# Altium schematic sheet CD74HC4067_MUX.SchDoc
size A
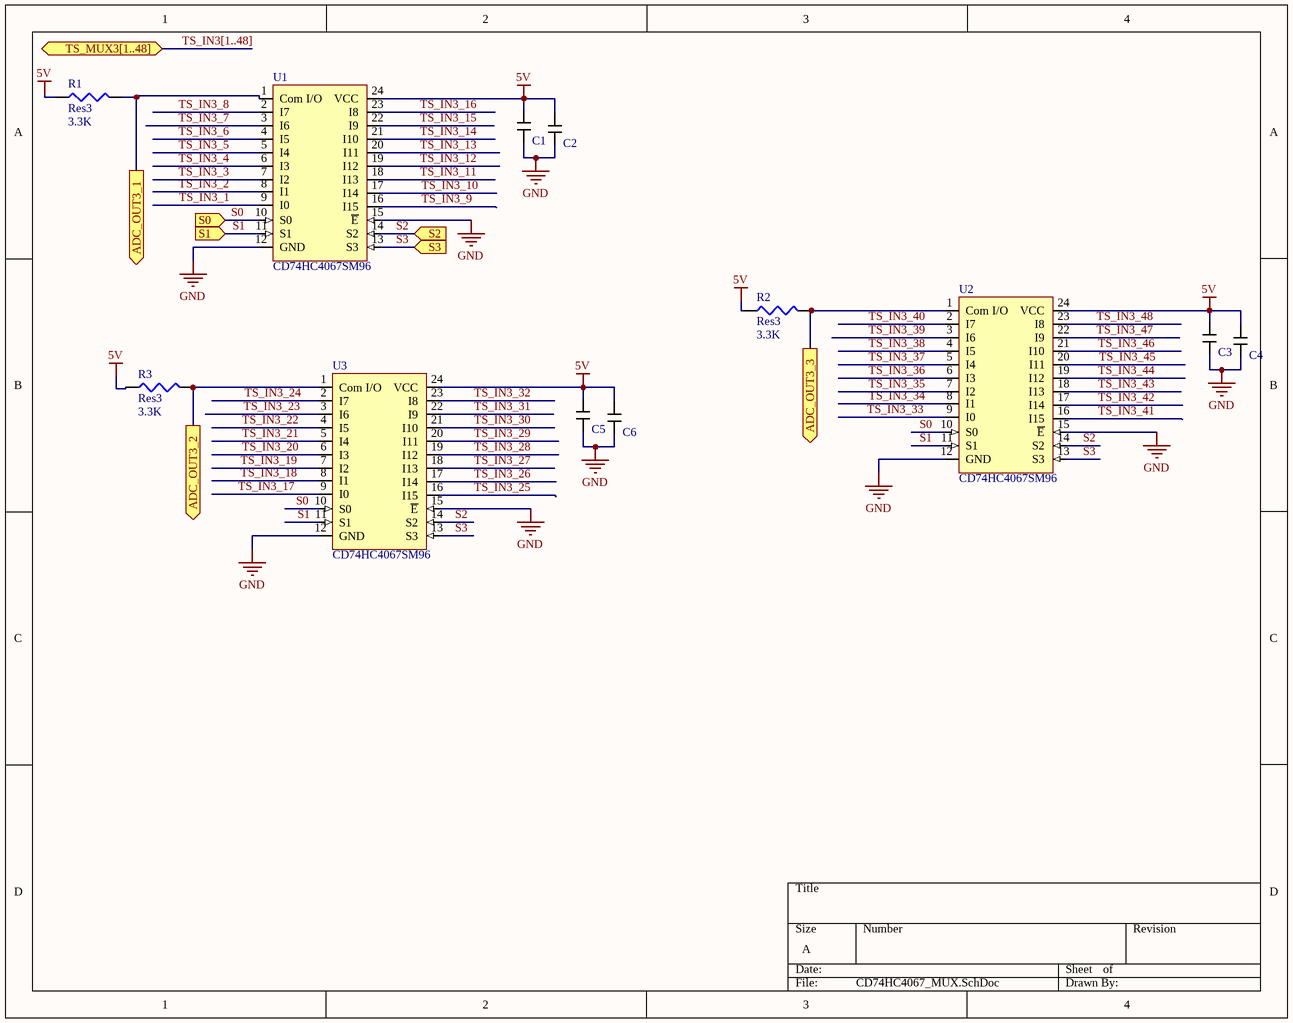
[diagram p0: CD74HC4067_MUX.SchDoc]

## Parts
C1  0.1uF Cap  [CAPC1608X09M]  (value not drawn)
C2  1uF Samsung Cap  [CAPC1608X09M]  (value not drawn)
C3  0.1uF Cap  [CAPC1608X09M]  (value not drawn)
C4  1uF Samsung Cap  [CAPC1608X09M]  (value not drawn)
C5  0.1uF Cap  [CAPC1608X09M]  (value not drawn)
C6  1uF Samsung Cap  [CAPC1608X09M]  (value not drawn)
R1  Res3  value 3.3K  [J1-0603]
R2  Res3  value 3.3K  [J1-0603]
R3  Res3  value 3.3K  [J1-0603]
U1  CD74HC4067SM96  [SOIC-24_MUX]
U2  CD74HC4067SM96  [SOIC-24_MUX]
U3  CD74HC4067SM96  [SOIC-24_MUX]

## Ports
ADC_OUT3_1 (out), ADC_OUT3_2 (out), ADC_OUT3_3 (out), S0 (in), S1 (in), S2 (in), S3 (in), TS_MUX3[1..48] (bidir)

## Nets
5V: C1.2 C2.2 C3.2 C4.2 C5.2 C6.2 R1.1 R2.1 R3.1 U1.24(VCC) U2.24(VCC) U3.24(VCC)
GND: C1.1 C2.1 C3.1 C4.1 C5.1 C6.1 U1.12(GND) U1.15(~{E}) U2.12(GND) U2.15(~{E}) U3.12(GND) U3.15(~{E})
ADC_OUT3_1: R1.2 U1.1(Com_I/O) ; port ADC_OUT3_1
ADC_OUT3_2: R3.2 U3.1(Com_I/O) ; port ADC_OUT3_2
ADC_OUT3_3: R2.2 U2.1(Com_I/O) ; port ADC_OUT3_3
S0: U1.10(S0) U2.10(S0) U3.10(S0) ; port S0
S1: U1.11(S1) U2.11(S1) U3.11(S1) ; port S1
S2: U1.14(S2) U2.14(S2) U3.14(S2) ; port S2
S3: U1.13(S3) U2.13(S3) U3.13(S3) ; port S3
TS_IN3_1: U1.9(I0)
TS_IN3_2: U1.8(I1)
TS_IN3_3: U1.7(I2)
TS_IN3_4: U1.6(I3)
TS_IN3_5: U1.5(I4)
TS_IN3_6: U1.4(I5)
TS_IN3_7: U1.3(I6)
TS_IN3_8: U1.2(I7)
TS_IN3_9: U1.16(I15)
TS_IN3_10: U1.17(I14)
TS_IN3_11: U1.18(I13)
TS_IN3_12: U1.19(I12)
TS_IN3_13: U1.20(I11)
TS_IN3_14: U1.21(I10)
TS_IN3_15: U1.22(I9)
TS_IN3_16: U1.23(I8)
TS_IN3_17: U3.9(I0)
TS_IN3_18: U3.8(I1)
TS_IN3_19: U3.7(I2)
TS_IN3_20: U3.6(I3)
TS_IN3_21: U3.5(I4)
TS_IN3_22: U3.4(I5)
TS_IN3_23: U3.3(I6)
TS_IN3_24: U3.2(I7)
TS_IN3_25: U3.16(I15)
TS_IN3_26: U3.17(I14)
TS_IN3_27: U3.18(I13)
TS_IN3_28: U3.19(I12)
TS_IN3_29: U3.20(I11)
TS_IN3_30: U3.21(I10)
TS_IN3_31: U3.22(I9)
TS_IN3_32: U3.23(I8)
TS_IN3_33: U2.9(I0)
TS_IN3_34: U2.8(I1)
TS_IN3_35: U2.7(I2)
TS_IN3_36: U2.6(I3)
TS_IN3_37: U2.5(I4)
TS_IN3_38: U2.4(I5)
TS_IN3_39: U2.3(I6)
TS_IN3_40: U2.2(I7)
TS_IN3_41: U2.16(I15)
TS_IN3_42: U2.17(I14)
TS_IN3_43: U2.18(I13)
TS_IN3_44: U2.19(I12)
TS_IN3_45: U2.20(I11)
TS_IN3_46: U2.21(I10)
TS_IN3_47: U2.22(I9)
TS_IN3_48: U2.23(I8)

## Buses and harness runs
bus TS_IN3[1..48] = port TS_MUX3[1..48]

## Library data of the parts
C1 C3 C5 = 0.1uF Cap: C0603C101K8GAC7867 Kemet Capacitor; Supplier 1: Digi-Key; Supplier Part Number 1: 399-14477-1-ND
R1-R3 = Res3: Resistor; Published: 8-Jun-2000; LatestRevisionDate: 29-May-2009; LatestRevisionNote: IPC-7351 Footprint Added.; PackageReference: J1-0603; Publisher: Altium Limited; PackageDescription: Chip Resistor
C2 C4 C6 = 1uF Samsung Cap: Supplier 1: Digi-Key; Supplier Part Number 1: 1276-1946-1-ND
U1-U3 = CD74HC4067SM96: Supplier Part Number 1: 05B6161; Supplier 1: Newark